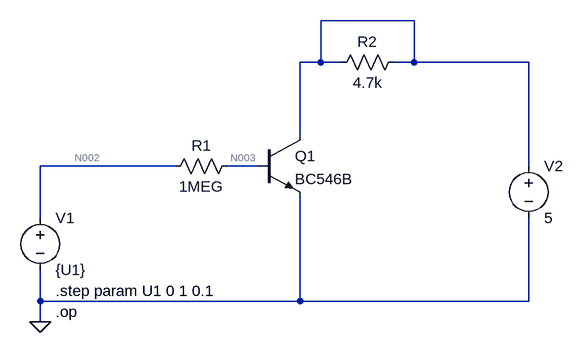
[diagram p0: schematic 1_Ic-Uce-characteristics.asc]
1_Ic-Uce-characteristics.asc, the LTspice schematic file:
Version 4
SHEET 1 1108 680
WIRE 640 -176 496 -176
WIRE 496 -112 496 -176
WIRE 496 -112 464 -112
WIRE 528 -112 496 -112
WIRE 640 -112 640 -176
WIRE 640 -112 608 -112
WIRE 688 -112 640 -112
WIRE 800 -112 688 -112
WIRE 816 -112 800 -112
WIRE 464 0 464 -112
WIRE 80 48 64 48
WIRE 192 48 80 48
WIRE 272 48 192 48
WIRE 400 48 352 48
WIRE 816 48 816 -112
WIRE 64 128 64 48
WIRE 64 256 64 208
WIRE 464 256 464 96
WIRE 464 256 64 256
WIRE 816 256 816 128
WIRE 816 256 464 256
WIRE 64 288 64 256
FLAG 64 288 0
DATAFLAG 80 48 ""
DATAFLAG 800 -112 "round($*1k)/1k"
DATAFLAG 192 48 "round(I(R1)*1k)/1k"
DATAFLAG 688 -112 "I(V2)"
SYMBOL voltage 64 112 R0
WINDOW 123 0 0 Left 2
WINDOW 39 0 0 Left 2
SYMATTR InstName V1
SYMATTR Value {U1}
SYMBOL npn3 400 0 R0
SYMATTR InstName Q1
SYMATTR Value BC546B
SYMBOL res 368 32 R90
WINDOW 0 0 56 VBottom 2
WINDOW 3 32 56 VTop 2
SYMATTR InstName R1
SYMATTR Value 1MEG
SYMBOL res 624 -128 R90
WINDOW 0 0 56 VBottom 2
WINDOW 3 32 56 VTop 2
SYMATTR InstName R2
SYMATTR Value 4.7k
SYMBOL voltage 816 32 R0
WINDOW 123 0 0 Left 2
WINDOW 39 0 0 Left 2
SYMATTR InstName V2
SYMATTR Value 5
TEXT 88 272 Left 2 !.op
TEXT 88 240 Left 2 !.step param U1 0 1 0.1

The netlist it stands for:
* 1_Ic-Uce-characteristics.asc
V1 N002 0 {U1}
Q1 N001 N003 0 0 BC546B
R1 N003 N002 1MEG
R2 N001 N001 4.7k
V2 N001 0 5
.model NPN NPN
.model PNP PNP
.lib standard.bjt
.op
.step param U1 0 1 0.1
.backanno
.end

* Results of the author's LTspice run, read from the files saved beside the schematic
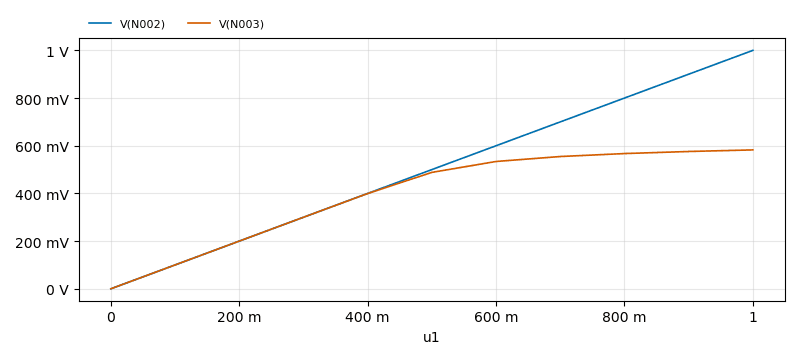
[diagram p1: Operating Point of 1_Ic-Uce-characteristics.asc, plotted from the saved traces]
* Operating Point, 1 run:
*   V(N002): 0 V at u1=0, 1 V at u1=1 , min 0 V, max 1 V
*   V(N003): 5.066 µV at u1=0, 582.5 mV at u1=1 , min 5.066 µV, max 582.5 mV
* From the log:
*   Semiconductor Device Operating Points:
*                           --- Bipolar Transistors ---
*   Name:       q1
*   Model:    bc546b
*   Ib:      -5.07e-12
*   Ic:       5.09e-12
*   Vbe:      5.07e-06
*   Vbc:     -5.00e+00
*   Vce:      5.00e+00
*   BetaDC:  -1.00e+00
*   Gm:       9.88e-13
*   Rpi:      9.16e+11
*   Rx:       1.00e+00
*   Ro:       2.64e+15
*   Cbe:      1.36e-11
*   Cbc:      1.07e-12
*   Cjs:      0.00e+00
*   BetaAC:   9.05e-01
*   Cbx:      6.58e-13
*   Ft:       4.83e-03